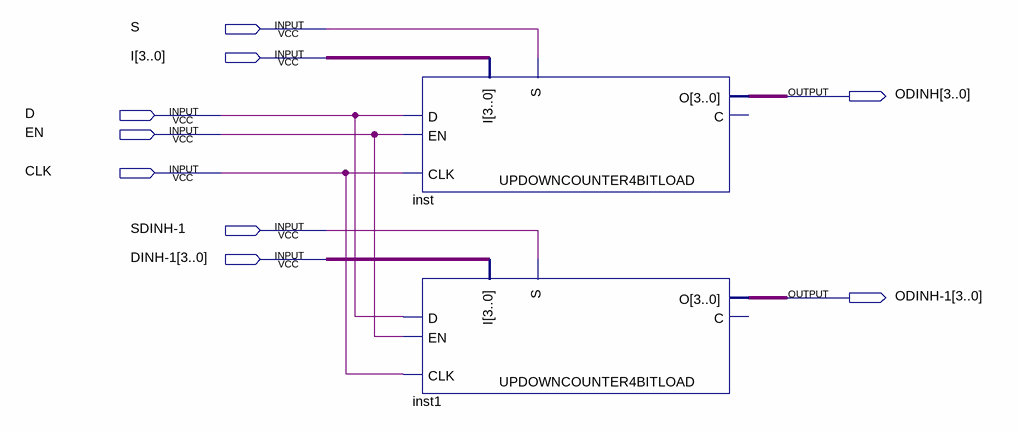
[diagram p0: schematic sheet]
// Quartus schematic DEM.bdf as structural Verilog: 2 symbols, 9 pins
module DEM (
  input  S,
  input  [3:0] I,
  input  D,
  input  EN,
  input  CLK,
  input  \SDINH-1 ,
  input  [3:0] \DINH-1 ,
  output [3:0] ODINH,
  output [3:0] \ODINH-1 
);

  UPDOWNCOUNTER4BITLOAD inst (.I(I), .S(S), .EN(EN), .D(D), .CLK(CLK), .O(ODINH));  // open: C
  UPDOWNCOUNTER4BITLOAD inst1 (.I(\DINH-1 ), .S(\SDINH-1 ), .EN(EN), .D(D), .CLK(CLK), .O(\ODINH-1 ));  // open: C
endmodule
